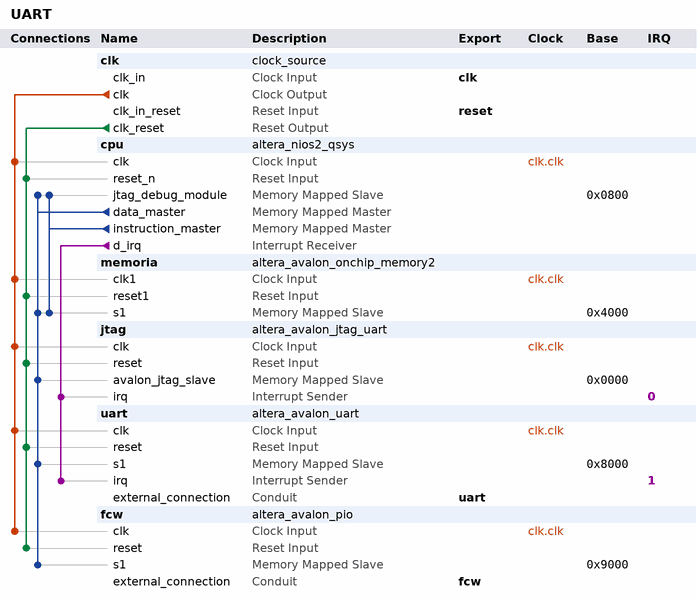
[diagram p0: system contents]
# Platform Designer (Qsys) system UART, Cyclone II EP2C5T144C8
# Parameters at their usual value, and those the tool derives, are not listed.
package require -exact qsys 13.0.1.99.2
create_system UART
set_project_property DEVICE_FAMILY {Cyclone II}
set_project_property DEVICE EP2C5T144C8

add_instance clk clock_source 13.0
set_instance_parameter_value clk clockFrequency 50000000

add_instance cpu altera_nios2_qsys 13.0
set_instance_parameter_value cpu resetSlave memoria.s1
set_instance_parameter_value cpu mmu_TLBMissExcSlave None
set_instance_parameter_value cpu exceptionSlave memoria.s1
set_instance_parameter_value cpu breakSlave cpu.jtag_debug_module
set_instance_parameter_value cpu impl Tiny
set_instance_parameter_value cpu icache_size 4096

add_instance memoria altera_avalon_onchip_memory2 13.0.1.99.2
set_instance_parameter_value memoria dataWidth 32
set_instance_parameter_value memoria dualPort false
set_instance_parameter_value memoria initMemContent true
set_instance_parameter_value memoria initializationFileName onchip_mem.hex
set_instance_parameter_value memoria memorySize 4096

add_instance jtag altera_avalon_jtag_uart 13.0.1.99.2
set_instance_parameter_value jtag simInteractiveOptions NO_INTERACTIVE_WINDOWS

add_instance uart altera_avalon_uart 13.0.1.99.2
set_instance_parameter_value uart baud 115200
set_instance_parameter_value uart dataBits 8
set_instance_parameter_value uart fixedBaud true
set_instance_parameter_value uart parity NONE
set_instance_parameter_value uart stopBits 1

add_instance fcw altera_avalon_pio 13.0.1.99.2
set_instance_parameter_value fcw direction Output
set_instance_parameter_value fcw width 8

# connections
add_connection clk.clk cpu.clk clock
add_connection clk.clk fcw.clk clock
add_connection clk.clk jtag.clk clock
add_connection clk.clk memoria.clk1 clock
add_connection clk.clk uart.clk clock
add_connection clk.clk_reset cpu.reset_n reset
add_connection clk.clk_reset fcw.reset reset
add_connection clk.clk_reset jtag.reset reset
add_connection clk.clk_reset memoria.reset1 reset
add_connection clk.clk_reset uart.reset reset
add_connection cpu.data_master cpu.jtag_debug_module avalon
set_connection_parameter_value cpu.data_master/cpu.jtag_debug_module baseAddress 0x0800
add_connection cpu.data_master fcw.s1 avalon
set_connection_parameter_value cpu.data_master/fcw.s1 baseAddress 0x9000
add_connection cpu.data_master jtag.avalon_jtag_slave avalon
set_connection_parameter_value cpu.data_master/jtag.avalon_jtag_slave baseAddress 0x0000
add_connection cpu.data_master memoria.s1 avalon
set_connection_parameter_value cpu.data_master/memoria.s1 baseAddress 0x4000
add_connection cpu.data_master uart.s1 avalon
set_connection_parameter_value cpu.data_master/uart.s1 baseAddress 0x8000
add_connection cpu.instruction_master cpu.jtag_debug_module avalon
set_connection_parameter_value cpu.instruction_master/cpu.jtag_debug_module baseAddress 0x0800
add_connection cpu.instruction_master memoria.s1 avalon
set_connection_parameter_value cpu.instruction_master/memoria.s1 baseAddress 0x4000
add_connection cpu.d_irq jtag.irq interrupt
set_connection_parameter_value cpu.d_irq/jtag.irq irqNumber 0
add_connection cpu.d_irq uart.irq interrupt
set_connection_parameter_value cpu.d_irq/uart.irq irqNumber 1

# exported interfaces
add_interface clk clock sink
set_interface_property clk EXPORT_OF clk.clk_in
add_interface reset reset sink
set_interface_property reset EXPORT_OF clk.clk_in_reset
add_interface uart conduit end
set_interface_property uart EXPORT_OF uart.external_connection
add_interface fcw conduit end
set_interface_property fcw EXPORT_OF fcw.external_connection

set_interconnect_requirement {$system} qsys_mm.clockCrossingAdapter HANDSHAKE
set_interconnect_requirement {$system} qsys_mm.maxAdditionalLatency 1

save_system UART.qsys
